# EasyEDA schematic Hotplate V1.1.json
TITLE: Sheet_1; REV: 1.0; Date: 2022-10-04; Sheet: 1/1; Drawn By: bombo1; Company: Your Company
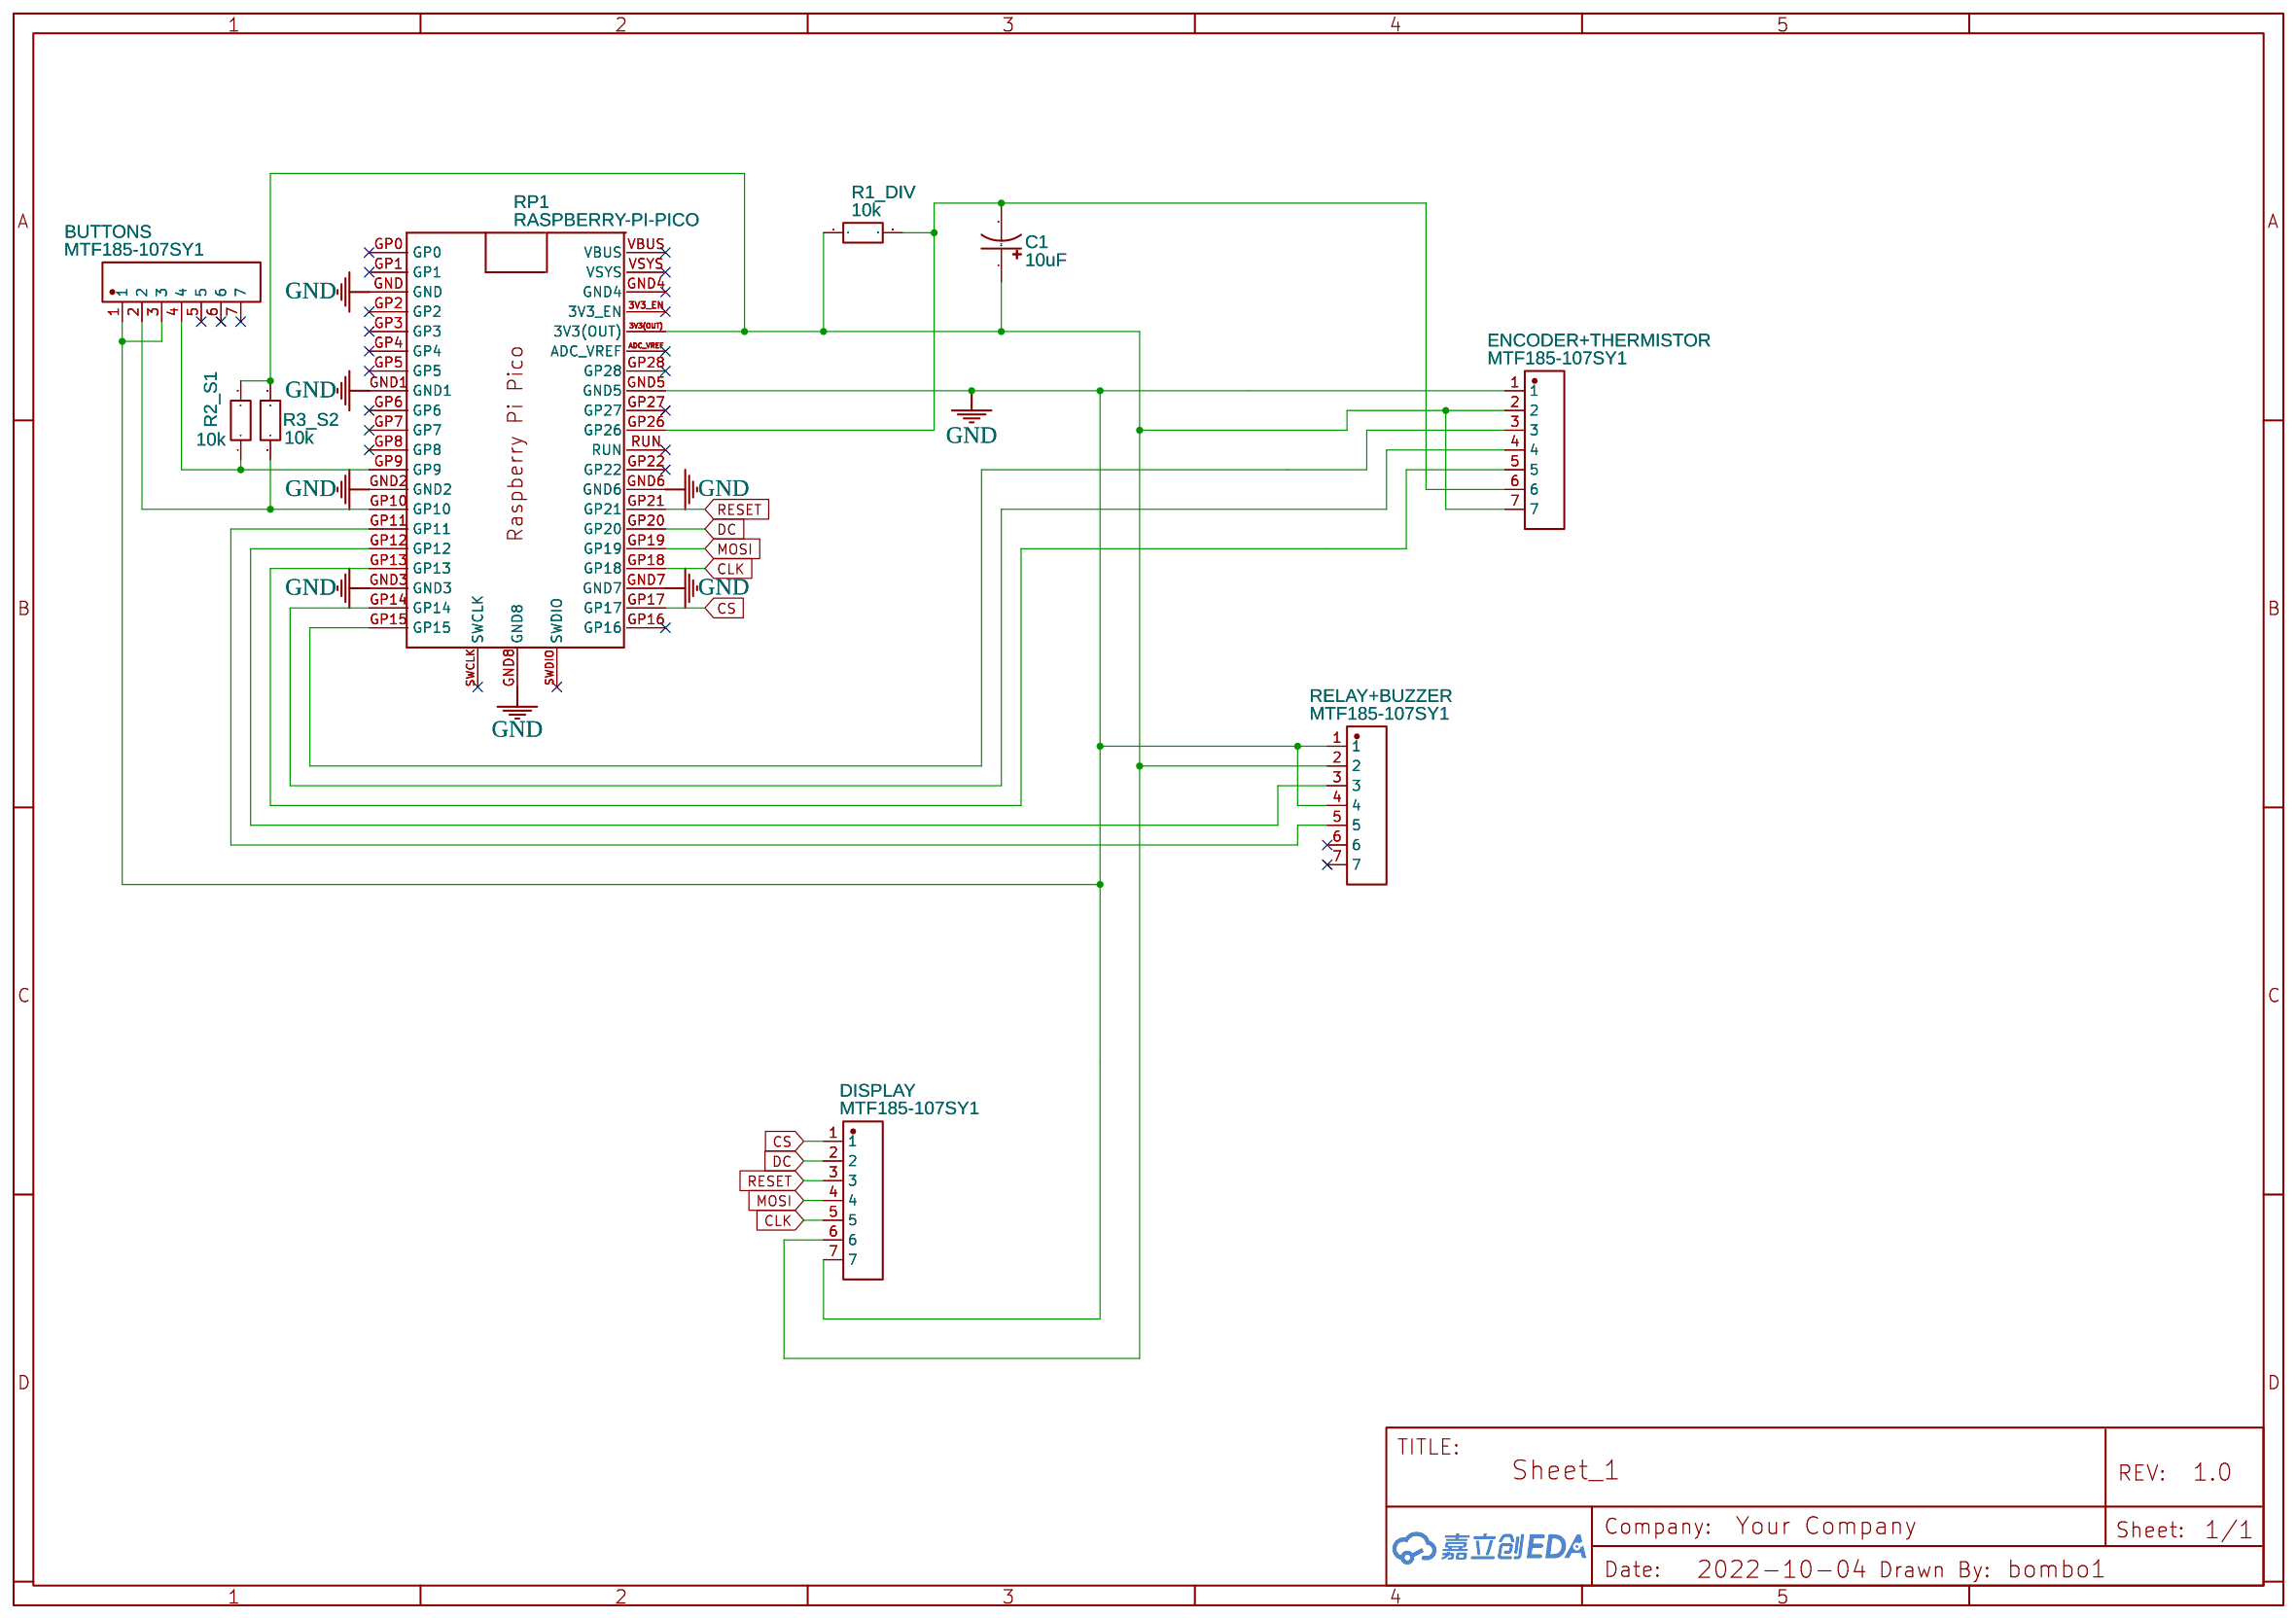
[diagram p0: schematic sheet]

## Parts
BUTTONS  MTF185-107SY1  [HDR-TH_7P-P2.54-V-F]
C1  10uF  [CAP-TH_D1.0-BD6.3-P2.50-L-FD]
DISPLAY  MTF185-107SY1  [HDR-TH_7P-P2.54-V-F]
ENCODER+THERMISTOR  MTF185-107SY1  [HDR-TH_7P-P2.54-V-F]
R1_DIV  10k  [RESISTOR1/4W10MM]
R2_S1  10k  [RESISTOR1/4W10MM]
R3_S2  10k  [RESISTOR1/4W10MM]
RELAY+BUZZER  MTF185-107SY1  [HDR-TH_7P-P2.54-V-F]
RP1  RASPBERRY-PI-PICO  [RASPBERRY-PI-PICO]

## Library data of the parts
BUTTONS DISPLAY ENCODER+THERMISTOR RELAY+BUZZER = MTF185-107SY1: Supplier: LCSC; Supplier Part: C358721; Manufacturer: MINTRON; Contributor: LCSC; JLCPCB Part Class: Extended Part
C1 = CAPACITOR: Supplier: LCSC; Supplier Part: C402592; Manufacturer: Capxon International Elec; Manufacturer Part: KM221M010E110A; Contributor: lagrenouille707
R1_DIV R2_S1 R3_S2 = resistor1/4w10mm: Contributor: Gergely Soki
RP1 = RASPBERRY-PI-PICO: Manufacturer: Raspberry Pi; Manufacturer Part: SC0915; Supplier: Elextra; Supplier Part: H51227; link: https://www.elextra.dk/p/raspberry-pi-pico/H51227; Contributor: trikerdk

## Nets
GND: BUTTONS.1 BUTTONS.3 DISPLAY.7 ENCODER+THERMISTOR.1 RELAY+BUZZER.1 RELAY+BUZZER.4 RP1.GND RP1.GND1 RP1.GND2 RP1.GND3 RP1.GND5 RP1.GND6 RP1.GND7 RP1.GND8
CLK: DISPLAY.5 RP1.GP18
CS: DISPLAY.1 RP1.GP17
DC: DISPLAY.2 RP1.GP20
MOSI: DISPLAY.4 RP1.GP19
RESET: DISPLAY.3 RP1.GP21
Net-(BUTTONS-2): BUTTONS.2 R3_S2.1 RP1.GP10
Net-(BUTTONS-4): BUTTONS.4 R2_S1.1 RP1.GP9
Net-(C1-1): C1.1 DISPLAY.6 ENCODER+THERMISTOR.2 ENCODER+THERMISTOR.7 R1_DIV.1 R2_S1.2 R3_S2.2 RELAY+BUZZER.2 RP1.3V3(OUT)
Net-(C1-2): C1.2 ENCODER+THERMISTOR.6 R1_DIV.2 RP1.GP26
Net-(ENCODER+THERMISTOR-3): ENCODER+THERMISTOR.3 RP1.GP15
Net-(ENCODER+THERMISTOR-4): ENCODER+THERMISTOR.4 RP1.GP14
Net-(ENCODER+THERMISTOR-5): ENCODER+THERMISTOR.5 RP1.GP13
Net-(RELAY+BUZZER-3): RELAY+BUZZER.3 RP1.GP12
Net-(RELAY+BUZZER-5): RELAY+BUZZER.5 RP1.GP11

Not connected (* = marked no-connect by the designer): BUTTONS 5* 6* 7*; RELAY+BUZZER 6* 7*; RP1 3V3_EN* ADC_VREF* GND4* GP0* GP1* GP2* GP3* GP4* GP5* GP6* GP7* GP8* GP16* GP22* GP27* GP28* RUN* SWCLK* SWDIO* VBUS* VSYS*
